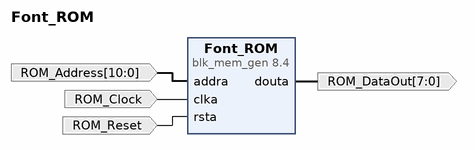
[diagram p0: block diagram of the top level]
# Vivado block design Font_ROM, xc7z010clg400-1, Vivado 2019.2
create_bd_design Font_ROM

create_bd_port -dir I -from 10 -to 0 ROM_Address
create_bd_port -dir I ROM_Clock
create_bd_port -dir O -from 7 -to 0 ROM_DataOut
create_bd_port -dir I ROM_Reset

create_bd_cell -type ip -vlnv xilinx.com:ip:blk_mem_gen:8.4 Font_ROM
set_property -dict [list \
  CONFIG.Coe_File ../../../../../../Font.coe \
  CONFIG.EN_SAFETY_CKT false \
  CONFIG.Enable_32bit_Address false \
  CONFIG.Enable_A Always_Enabled \
  CONFIG.Load_Init_File true \
  CONFIG.Memory_Type Single_Port_ROM \
  CONFIG.Port_A_Write_Rate 0 \
  CONFIG.Register_PortA_Output_of_Memory_Primitives true \
  CONFIG.Write_Depth_A 2048 \
  CONFIG.Write_Width_A 8 \
  CONFIG.use_bram_block Stand_Alone \
] [get_bd_cells Font_ROM]

# ---- connections ----

connect_bd_net -net addra_1 [get_bd_ports ROM_Address] [get_bd_pins Font_ROM/addra]
connect_bd_net -net clka_1 [get_bd_ports ROM_Clock] [get_bd_pins Font_ROM/clka]
connect_bd_net -net blk_mem_gen_0_douta [get_bd_pins Font_ROM/douta] [get_bd_ports ROM_DataOut]
connect_bd_net -net rsta_1 [get_bd_ports ROM_Reset] [get_bd_pins Font_ROM/rsta]

validate_bd_design
save_bd_design
